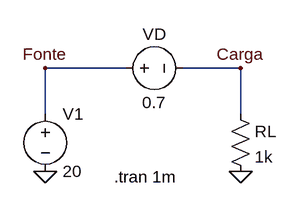
[diagram p0: schematic Diodo 3-9 (2-aproximacao).asc]
Diodo 3-9 (2-aproximacao).asc, the LTspice schematic file:
Version 4
SHEET 1 880 680
WIRE 144 64 32 64
WIRE 304 64 224 64
WIRE 32 128 32 64
WIRE 304 128 304 64
FLAG 32 208 0
FLAG 304 208 0
FLAG 304 64 Carga
FLAG 32 64 Fonte
SYMBOL voltage 32 112 R0
SYMATTR InstName V1
SYMATTR Value 20
SYMBOL voltage 128 64 R270
WINDOW 0 32 56 VTop 2
WINDOW 3 -32 56 VBottom 2
SYMATTR InstName VD
SYMATTR Value 0.7
SYMBOL res 288 112 R0
SYMATTR InstName RL
SYMATTR Value 1k
TEXT 128 216 Left 2 !.tran 1m

The netlist it stands for:
* Diodo 3-9 (2-aproximacao).asc
V1 Fonte 0 20
VD Fonte Carga 0.7
RL Carga 0 1k
.tran 1m
.backanno
.end